# EAGLE design DC-filter (EAGLE 7.7.0)
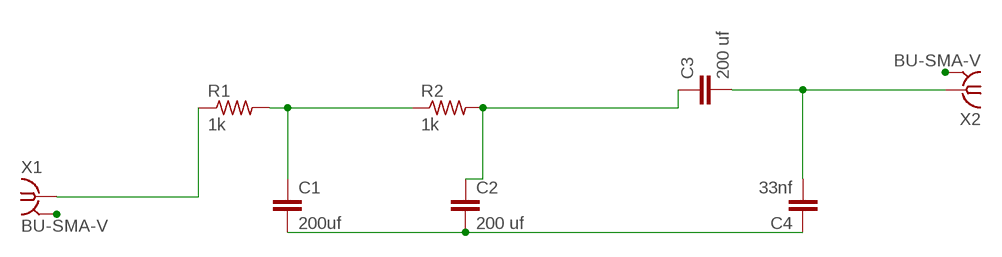
[diagram p0: schematic, sheet 1]

## Parts
C1  200uf  C-EUC1310  [C1310]
C2  200 uf  C-EUC1310  [C1310]
C3  200 uf  C-EUC1310  [C1310]
C4  33nf  C-EUC1310  [C1310]
R1  1k  R-US_0204/7  [0204/7]
R2  1k  R-US_0204/7  [0204/7]
X1  BU-SMA-V  [BU-SMA-V]
X2  BU-SMA-V  [BU-SMA-V]

## Nets
GND: X1.2 X1.3 X1.4 X1.5 X2.2 X2.3 X2.4 X2.5
N$1: R1.1 X1.1
N$2: C1.1 R1.2 R2.1
N$3: C2.1 C3.1 R2.2
N$4: C3.2 C4.2 X2.1
N$5: C1.2 C2.2 C4.1

## Library data of the parts
C1-C4 = rcl:C-EU: CAPACITOR, European symbol
R1 R2 = rcl:R-US_: RESISTOR, American symbol
X1 X2 = con-coax:BU-SMA-V: FEMALE SMA CONNECTOR Radiall distributor RS 112-3794; OC_FARNELL: unknown; OC_NEWARK: unknown

## Board
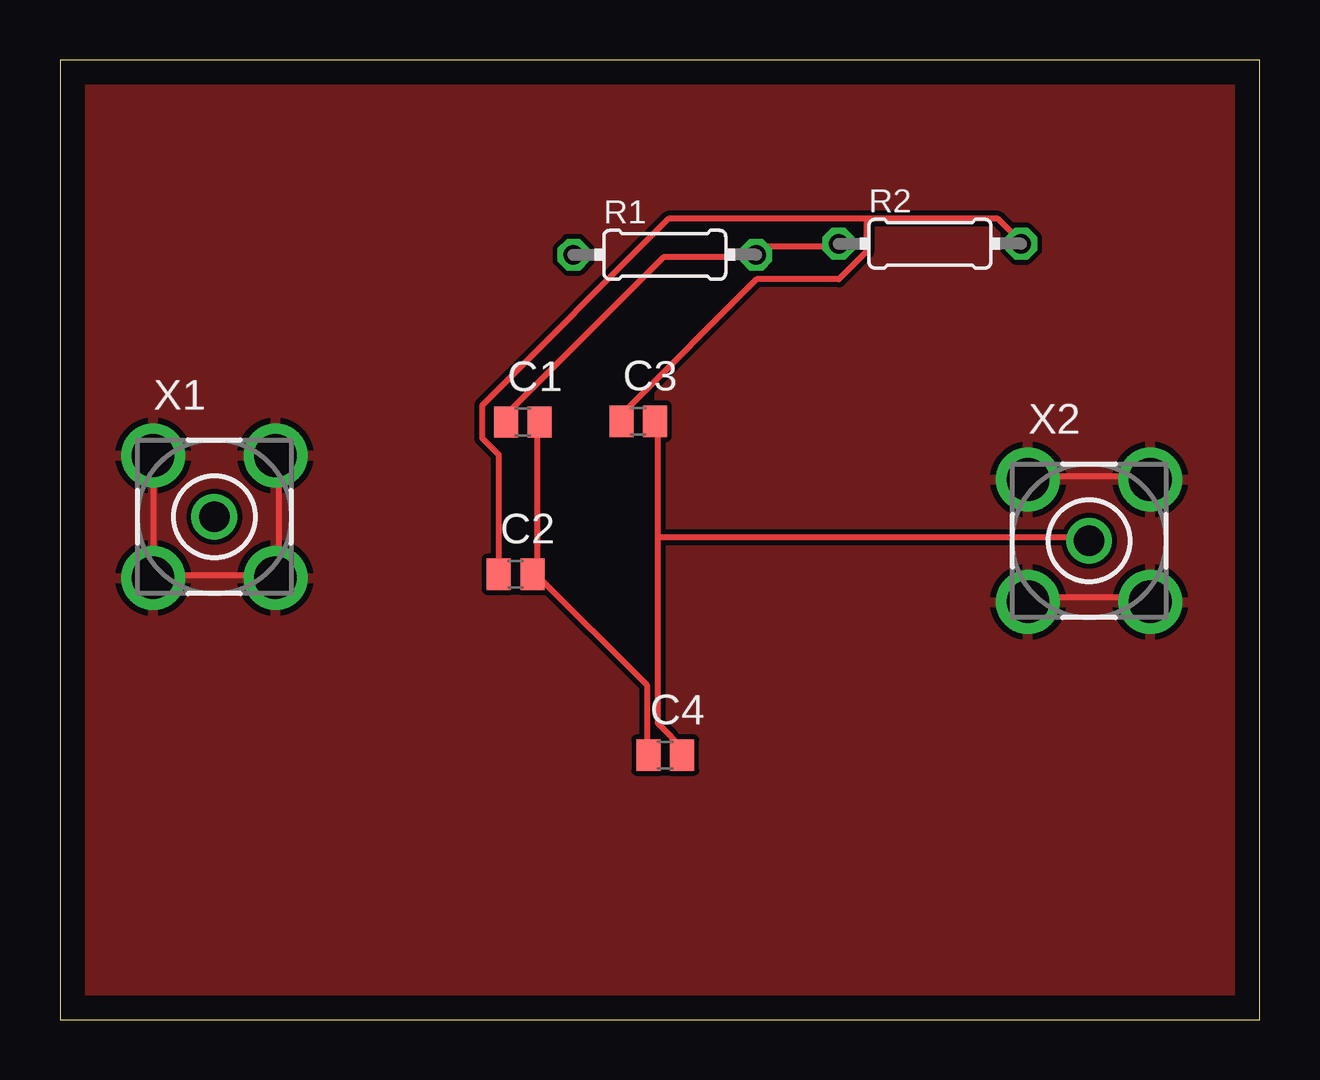
[diagram p1: board, top side]
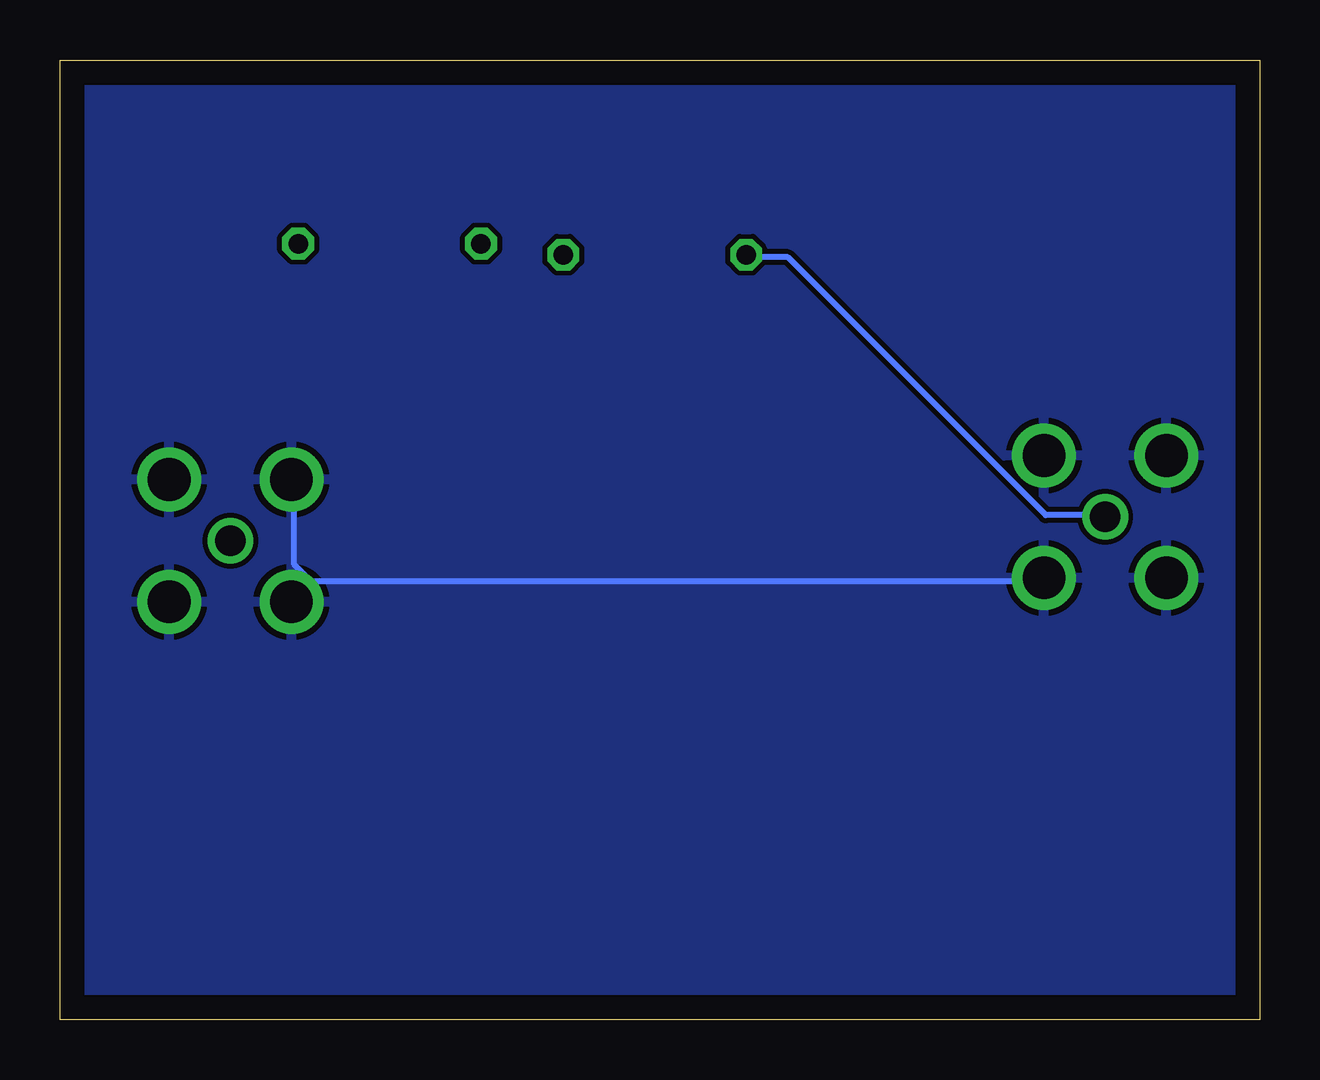
[diagram p2: board, bottom side, seen from below]

Size 50 x 40 mm. Coordinates in mm from the lower left corner, seen from the top.
Outline: 0,0 50,0 50,40 0,40 0,0
Copper layers (1*16): Top 0.035mm / dielectric 1.5mm / Bottom 0.035mm
Design rules "default": minimum track width 10mil, minimum drill 24mil, track to track 8mil, track to pad 8mil, pad to pad 8mil, via to via 8mil, smd to smd 8mil, copper to edge 40mil, drill to drill 8mil, minimum pad ring 10mil, minimum via ring 8mil, stop-mask expansion 4mil, vias tented up to drill 0mil, thermal gap 10mil

### Footprints (pad centres in the part's own frame; a part is rotated, then mirrored left to right if it is on the bottom)
C1310 = smd 1 x 1.3: 1 -0.7,0; 2 0.7,0
0204/7 = drill 0.813 octagon: 1 -3.81,0; 2 3.81,0
BU-SMA-V = drill 1.27: 1 0,0 | drill 1.778: 2 -2.55,2.55; 3 2.55,2.55; 4 2.55,-2.55; 5 -2.55,-2.55

### Placement (x,y rotation side)
C1  19.29,24.91 0 top
C2  18.99,18.56 0 top
C3  24.1,24.94 0 top
C4  25.23,11.02 0 top
R1  25.21,31.88 0 top
R2  36.26,32.34 0 top
X1  6.43,20.96 0 top
X2  42.9,19.96 0 top

### Tracks (layer width: path | path; a pad name or v marks a point on that pad's centre or on a via)
GND
  Top 0.254: 3.89,18.52 3.89,23.32 X1.2 | 3.89,18.52 8.91,18.52 X1.4 9.14,18.52 9.14,23.32 X1.3 | 3.89,18.52 X1.5 | X2.2 40.46,22.63 45.26,22.63 X2.3 | X2.5 40.46,17.6 45.26,17.6 X2.4
  Bottom 0.254: 39.55,18.29 9.14,18.29 X1.4 | 39.55,18.29 40.23,17.6 X2.5 39.55,18.29 | 39.55,18.29 40.23,18.97 40.23,22.4 X2.2
  pour Bottom: 0,40 50,40 50,0 0,0
  pour Top: 0,40 50,40 50,0 0,0
N$1
  Bottom 0.254: R1.1 21.26,31.77 19.66,31.77 8.91,21.03 6.63,21.03 X1.1
N$2
  Top 0.254: C1.1 18.75,24.92 18.75,25.38 25.15,31.77 28.8,31.77 R1.2 29.03,32 29.26,32.23 32.23,32.23 R2.1
N$3
  Top 0.254: 33.6,33.38 39.09,33.38 40.01,32.46 R2.2 | 33.6,33.38 25.38,33.38 17.6,25.6 17.6,24.23 18.29,23.55 18.29,18.75 C2.1 | 33.6,33.38 33.6,32 32.46,30.86 29.03,30.86 23.55,25.38 23.55,25.15 C3.1
N$4
  Top 0.254: 24.92,20.12 24.92,12.34 26.06,11.2 C4.2 | 24.92,20.12 24.92,24.92 C3.2 | 24.92,20.12 42.75,20.12 X2.1
N$5
  Top 0.254: C1.2 19.89,24.69 19.89,18.75 C2.2 19.89,18.52 24.46,13.95 24.46,11.2 C4.1